# Altium project ESP_Dent.PrjPcb (part 3 of 3)
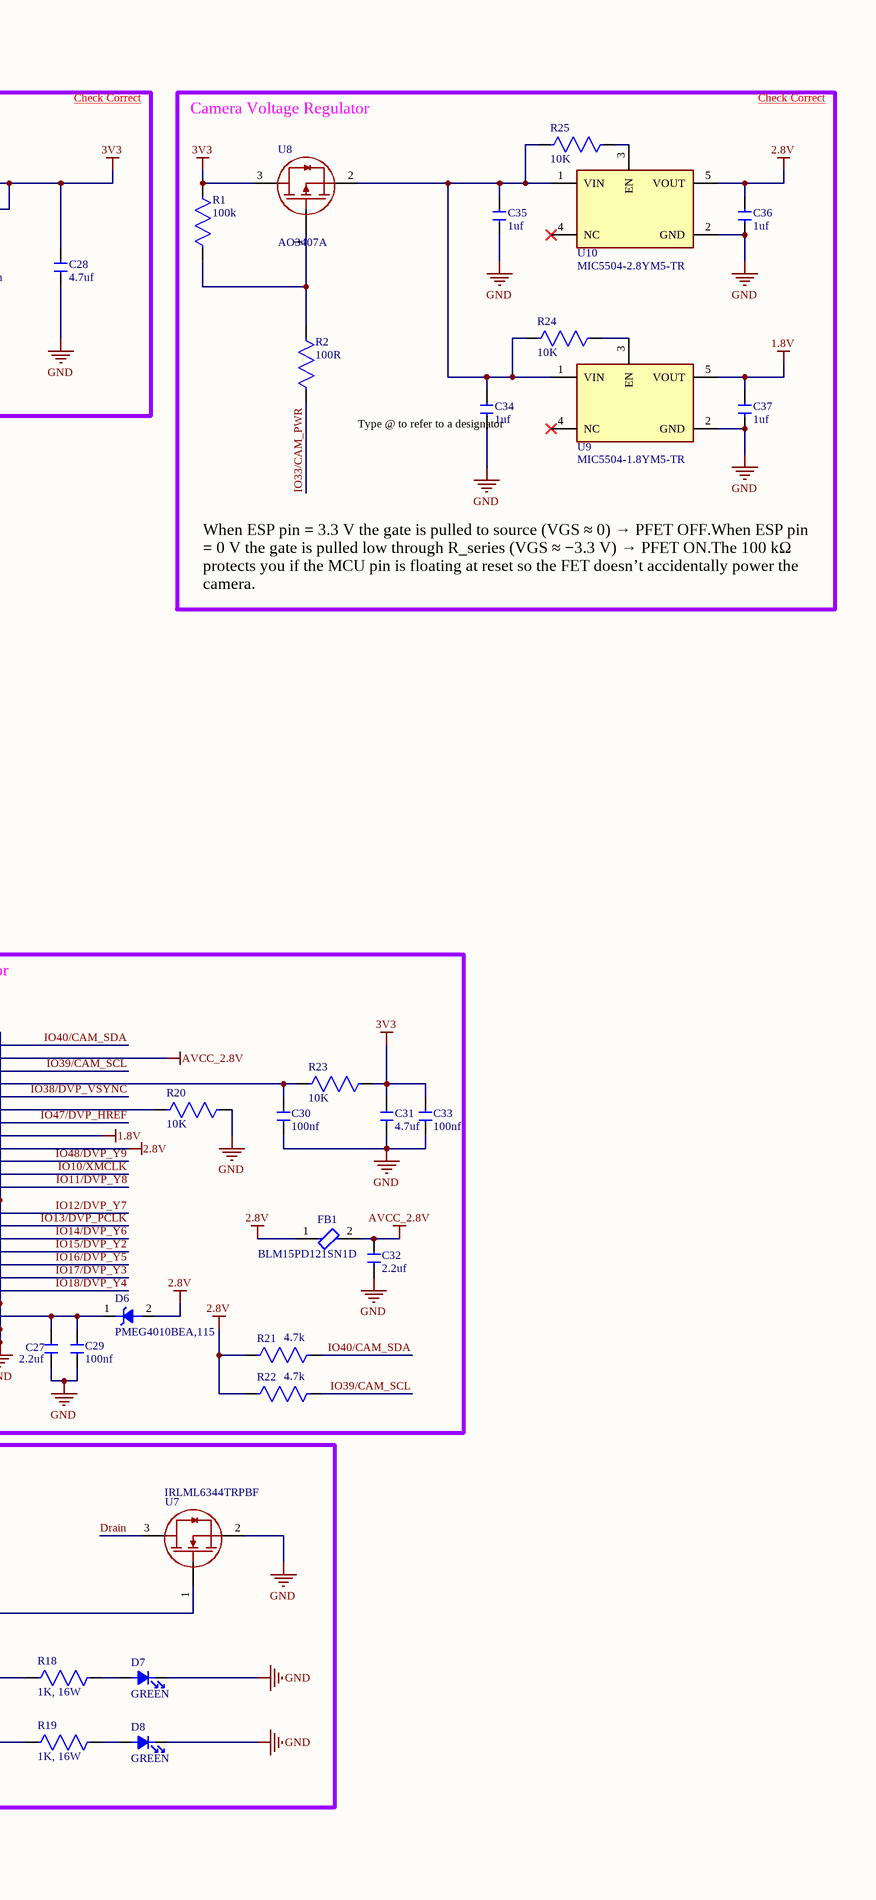
[diagram p3: Dent_Sheet_ESP.SchDoc, right]

## Sheet Dent_Sheet_ESP.SchDoc (continued)

### Library data of the parts (continued)
U1 = ESP32-S3R8: IC RF TXRX+MCU BLE 56QFN; Manufacturer: Espressif Systems; Supplier: Digikey; Supplier Part Number: 1904-ESP32-S3R8CT-ND; Manufacturer Part Number: ESP32-S3R8; RoHS: No; Category: RF Receivers, Transceivers; Stock: 792; Pricing: 1=2.3, 2000=2.28001 (USD); ComponentLink1URL: https://datasheet.octopart.com/ESP32-S3R8-Espressif-Systems-datasheet-188867343.pdf?src-supplier=TME; ComponentLink1Description: https://datasheet.octopart.com/ESP32-S3R8-Espressif-Systems-datasheet-188867343.pdf?src-supplier=TME; LCSC Part No.: C2913194
U2 = DMG3415U-7: P-Channel 20 V 4A (Ta) 900mW (Ta) Surface Mount SOT-23-3; Manufacturer: Diodes; Package Body Material: Plastic; Transistor Element Material: SILICON; Additional Feature: HIGH RELIABILITY; Drain-source On Resistance-Max: 42.5mR; DS Breakdown Voltage-Min: 20V; FET Technology: METAL-OXIDE SEMICONDUCTOR; Number of Elements: 1; Operating Mode: ENHANCEMENT MODE; Time @ Peak Reflow Temperature-Max (s): 40s; Transistor Application: SWITCHING; Qualification Status: Not Qualified; Supplier: Digikey; Supplier Part Number: DMG3415UDICT-ND; Manufacturer Part Number: DMG3415U-7; RoHS: Yes; Category: MOSFETs; Stock: 10798; Pricing: 1=0.45, 10=0.277, 100=0.1743, 500=0.13838 (USD); Pins: 3; Package Shape: Rectangular; Terminal Finish: Tin; Max Operating Temperature: 150°C; JESD-609 Code: e3; Polarity/Channel Type: P-CHANNEL; Drain Current-Max (Abs) (ID): 4A; Drain Current-Max (ID): 4A; JESD-30 Code: R-PDSO-G3; Moisture Sensitivity Level: 1; Package Style: SMALL OUTLINEMeter; Peak Reflow Temperature (Cel): 260°C; Power Dissipation-Max (Abs): 900mW; Surface Mount: Yes; Terminal Form: Gull Wing; Terminal Position: DUAL; Reach SVHC Compliant: Yes; RoHS Compliant: Yes; ComponentLink1URL: https://datasheet.ciiva.com:443/pdfs/VipMasterIC/IC/DIOD/DIOD-S-A0004428614/DIOD-S-A0004428614-1.pdf?src-supplier=IHS+Markit; ComponentLink1Description: https://datasheet.ciiva.com:443/pdfs/VipMasterIC/IC/DIOD/DIOD-S-A0004428614/DIOD-S-A0004428614-1.pdf?src-supplier=IHS+Markit; ComponentLink2URL: https://datasheet.ciiva.com/11174/ds31735-11174977.pdf?src-supplier=Avnet; ComponentLink2Description: https://datasheet.ciiva.com/11174/ds31735-11174977.pdf?src-supplier=Avnet; ComponentLink3URL: https://datasheet.ciiva.com/13061/ds31735-64958-13061831.pdf?src-supplier=Mouser; ComponentLink3Description: https://datasheet.ciiva.com/13061/ds31735-64958-13061831.pdf?src-supplier=Mouser; ComponentLink4URL: https://datasheet.ciiva.com/935/ds31735-935013.pdf?src-supplier=Digikey; ComponentLink4Description: https://datasheet.ciiva.com/935/ds31735-935013.pdf?src-supplier=Digikey; ComponentLink5URL: https://datasheet.ciiva.com/935/ds31735-935014.pdf?src-supplier=Digikey; ComponentLink5Description: https://datasheet.ciiva.com/935/ds31735-935014.pdf?src-supplier=Digikey; ComponentLink6URL: https://datasheet.ciiva.com/935/ds31735-935015.pdf?src-supplier=Digikey; ComponentLink6Description: https://datasheet.ciiva.com/935/ds31735-935015.pdf?src-supplier=Digikey; ComponentLink7URL: https://datasheet.ciiva.com/8115/ds31735-8115357.pdf?src-supplier=Avnet; ComponentLink7Description: https://datasheet.ciiva.com/8115/ds31735-8115357.pdf?src-supplier=Avnet; ComponentLink8URL: https://datasheet.ciiva.com/8023/ds31735-8023980.pdf?src-supplier=Element14; ComponentLink8Description: https://datasheet.ciiva.com/8023/ds31735-8023980.pdf?src-supplier=Element14; ComponentLink9URL: https://datasheet.ciiva.com/22712/1915618-22712394.pdf?src-supplier=Element14; ComponentLink9Description: https://datasheet.ciiva.com/22712/1915618-22712394.pdf?src-supplier=Element14; ComponentLink10URL: https://datasheet.ciiva.com/16387/ds31735-16387485.pdf?src-supplier=Future+Electronics; ComponentLink10Description: https://datasheet.ciiva.com/16387/ds31735-16387485.pdf?src-supplier=Future+Electronics; LCSC Part No.: C96616
U4 = MCP73831T-2ACI/OT: IC BATT CNTL LI-ION 1CEL SOT23-5; Manufacturer: Microchip; Package Body Material: Plastic; Adjustable Threshold: Yes; Throw Configuration: POWER SUPPLY SUPPORT CIRCUIT; Number of Channels: 1; Package Equivalence Code: TSOP5/6,.11,37; Power Supplies: 3.3/5V; Supply Current-Max (Isup): 1.5mA; Max Supply Voltage: 6V; Min Supply Voltage: 3.75V; Nominal Supply Voltage: 5.2V; Time @ Peak Reflow Temperature-Max (s): 40s; Qualification Status: Not Qualified; Supplier: Digikey; Supplier Part Number: MCP73831T-2ACI/OTCT-ND; Manufacturer Part Number: MCP73831T-2ACI/OT; RoHS: Yes; Category: Battery Management; Stock: 33354; Pricing: 1=0.76, 25=0.63, 100=0.6125, 3000=0.5831 (USD); Case/Package: LSSOP; Pins: 5; Package Shape: Rectangular; Terminal Finish: Tin; Min Operating Temperature: -40°C; Max Operating Temperature: 85°C; JESD-609 Code: e3; JESD-30 Code: R-PDSO-G5; Moisture Sensitivity Level: 1; Channels: 1; Package Style: SMALL OUTLINE, LOW PROFILE, SHRINK PITCHMeter; Peak Reflow Temperature (Cel): 260°C; Surface Mount: Yes; Terminal Form: Gull Wing; Terminal Position: DUAL; Length: 2.95mm; Width: 1.65mm; Height - Seated (Max): 1.45mm; Terminal Pitch: 0.95mm; Temperature Grade: INDUSTRIAL; Reach SVHC Compliant: Yes; RoHS Compliant: Yes; ComponentLink1URL: https://datasheet.ciiva.com:443/pdfs/VipMasterIC/IC/MCHP/MCHPS05673/MCHPS05673-1.pdf?src-supplier=IHS+Markit; ComponentLink1Description: https://datasheet.ciiva.com:443/pdfs/VipMasterIC/IC/MCHP/MCHPS05673/MCHPS05673-1.pdf?src-supplier=IHS+Markit; ComponentLink2URL: https://datasheet.ciiva.com/22828/0900766b80d2b53a-22828876.pdf?src-supplier=Rs; ComponentLink2Description: https://datasheet.ciiva.com/22828/0900766b80d2b53a-22828876.pdf?src-supplier=Rs; ComponentLink3URL: https://datasheet.ciiva.com/1137/630369-1137803.pdf?src-supplier=Element14; ComponentLink3Description: https://datasheet.ciiva.com/1137/630369-1137803.pdf?src-supplier=Element14; ComponentLink4URL: https://datasheet.ciiva.com/46385/630369-46385324.pdf?src-supplier=Element14; ComponentLink4Description: https://datasheet.ciiva.com/46385/630369-46385324.pdf?src-supplier=Element14; ComponentLink5URL: https://datasheet.ciiva.com/16286/filehandler-aspxddocname-en025112-16286957.pdf?src-supplier=Future+Electronics; ComponentLink5Description: https://datasheet.ciiva.com/16286/filehandler-aspxddocname-en025112-16286957.pdf?src-supplier=Future+Electronics; ComponentLink6URL: https://datasheet.ciiva.com/1931/21984e-1931954.pdf?src-supplier=Digikey; ComponentLink6Description: https://datasheet.ciiva.com/1931/21984e-1931954.pdf?src-supplier=Digikey; ComponentLink7URL: https://datasheet.ciiva.com/1931/21984e-1931955.pdf?src-supplier=Digikey; ComponentLink7Description: https://datasheet.ciiva.com/1931/21984e-1931955.pdf?src-supplier=Digikey; ComponentLink8URL: https://datasheet.ciiva.com/1931/21984e-1931953.pdf?src-supplier=Digikey; ComponentLink8Description: https://datasheet.ciiva.com/1931/21984e-1931953.pdf?src-supplier=Digikey; LCSC Part No.: C42432883
U5 = GD25Q64ETIGR: 2.7V~3.6V -40℃~85℃ 64MBIT 133MHZ SOP-8-150MIL Nor Flash Rohs; Manufacturer: GigaDevice; Interface: Serial; Max Supply Current: 25mA; Max Supply Voltage: 3.6V; Min Supply Voltage: 3V; Number of Circuits: 1; Operating Supply Voltage: 3.3V; Supplier: DigiKey; Supplier Part Number: 1970-GD25Q64ETIGRCT-ND; Manufacturer Part Number: GD25Q64ETIGR; RoHS: Compliant; Category: Flash; Stock: 3294; Pricing: 1=1.05, 10=0.985, 25=0.958, 50=0.9372, 100=0.9161, 250=0.8882, 500=0.8671, 1000=0.8461 (USD); Clock Rate: 133MHz; Height - Seated (Max): 1.75mm; Length: 4.9mm; Max Operating Temperature: 85°C; Memory Format: FLASH; Min Operating Temperature: -40°C; Number of Terminals: 8; Terminal Pitch: 1.27mm; Width: 3.9mm; ComponentLink1URL: https://datasheet.octopart.com:443/GD25Q64ETIGR-GigaDevice-datasheet-182344543.pdf?src-supplier=IHS; ComponentLink1Description: https://datasheet.octopart.com:443/GD25Q64ETIGR-GigaDevice-datasheet-182344543.pdf?src-supplier=IHS; LCSC Part No.: C2976334
U6 = TPS628438DRLR: Buck Switching Regulator IC Positive Programmable 1.8V 1 Output 600mA SOT-563, SOT-666; Manufacturer: Texas Instruments; Supplier: Digikey; Supplier Part Number: 296-TPS628438DRLRCT-ND; Manufacturer Part Number: TPS628438DRLR; RoHS: No; Category: LDO; Stock: 2001; Pricing: 1=1.55, 10=1.13, 25=1.026, 100=0.9116, 250=0.857, 500=0.82408, 1000=0.79698 (USD); LCSC Part No.: C38060243
U7 = IRLML6344TRPBF: MOSFET N-CH 30V 5A MICRO3/SOT23; Manufacturer: Infineon; Manufacturer Package Identifier: Micro3; Drain to Source Resistance: 29mΩ; Element Configuration: Single; Fall Time: 9.1ns; Gate to Source Voltage (Vgs): 12V; Input Capacitance: 650pF; Max Junction Temperature (Tj): 150°C; Max Power Dissipation: 1.3W; Nominal Vgs: 800mV; Number of Channels: 1; Recovery Time: 15ns; Value: 37MΩ; Rise Time: 5.6ns; Turn-Off Delay Time: 22ns; Turn-On Delay Time: 4.2ns; Supplier: DigiKey; Supplier Part Number: IRLML6344TRPBFCT-ND; Manufacturer Part Number: IRLML6344TRPBF; RoHS: Compliant; Category: MOSFETs; Stock: 89780; Pricing: 1=0.38, 10=0.249, 100=0.1612, 500=0.1424, 1000=0.12703 (USD); Case/Package: SOT-23; Continuous Drain Current (ID): 5A; Drain to Source Breakdown Voltage: 30V; Drain to Source Voltage (Vdss): 30V; Height: 1.12mm; Lead Free: Lead Free; Length: 3.04mm; Lifecycle Status: Production; Max Operating Temperature: 150°C; Min Breakdown Voltage: 30V; Min Operating Temperature: -55°C; Mounting Technology: Surface Mount; Number of Elements: 1; Pins: 3; Number of Terminals: 3; On-State Resistance: 29mΩ; Package Quantity: 3000; Packaging: Tape & Reel; Power Dissipation: 1.3W; Radiation Hardening: No; Rds On Max: 29mΩ; REACH SVHC: Yes; Schedule B: 8541290080, 8541290080|8541290080|8541290080|8541290080|8541290080; Threshold Voltage: 800mV; Width: 1.4mm; ComponentLink1URL: https://datasheet.octopart.com:443/IRLML6344TRPBF-Infineon-datasheet-166549069.pdf?src-supplier=IHS; ComponentLink1Description: https://datasheet.octopart.com:443/IRLML6344TRPBF-Infineon-datasheet-166549069.pdf?src-supplier=IHS; ComponentLink2URL: https://datasheet.octopart.com:443/IRLML6344TRPBF-Infineon-datasheet-41230536.pdf?src-supplier=element14+APAC; ComponentLink2Description: https://datasheet.octopart.com:443/IRLML6344TRPBF-Infineon-datasheet-41230536.pdf?src-supplier=element14+APAC; ComponentLink3URL: https://datasheet.octopart.com:443/IRLML6344TRPBF-Infineon-datasheet-10031181.pdf?src-supplier=Farnell; ComponentLink3Description: https://datasheet.octopart.com:443/IRLML6344TRPBF-Infineon-datasheet-10031181.pdf?src-supplier=Farnell; ComponentLink4URL: https://sigma.octopart.com:443/138896058/technical_drawing/Infineon-IRLML6344TRPBF.pdf?src-supplier=Upverter; ComponentLink4Description: https://sigma.octopart.com:443/138896058/technical_drawing/Infineon-IRLML6344TRPBF.pdf?src-supplier=Upverter; ComponentLink5URL: https://datasheet.octopart.com:443/IRLML6344TRPBF-International-Rectifier-datasheet-14062076.pdf?src-supplier=iiiC; ComponentLink5Description: https://datasheet.octopart.com:443/IRLML6344TRPBF-International-Rectifier-datasheet-14062076.pdf?src-supplier=iiiC; ComponentLink6URL: http://sigma.octopart.com:80/conflict_mineral_statement/Infineon-company-51.pdf?src-supplier=Compliance+Statements; ComponentLink6Description: http://sigma.octopart.com:80/conflict_mineral_statement/Infineon-company-51.pdf?src-supplier=Compliance+Statements; ComponentLink7URL: http://sigma.octopart.com:80/rohs_statement/International-Rectifier-company-54.pdf?src-supplier=Compliance+Statements; ComponentLink7Description: http://sigma.octopart.com:80/rohs_statement/International-Rectifier-company-54.pdf?src-supplier=Compliance+Statements; ComponentLink8URL: http://sigma.octopart.com:80/reach_statement/International-Rectifier-company-55.pdf?src-supplier=Compliance+Statements; ComponentLink8Description: http://sigma.octopart.com:80/reach_statement/International-Rectifier-company-55.pdf?src-supplier=Compliance+Statements; LCSC Part No.: C53550
U8 = AO3407A: 30V 4.3A 48mΩ@10V 2.5V@250uA 1 P-Channel SOT-23 MOSFETs ROHS; Manufacturer: Alpha & Omega Semiconductor; Package Body Material: Plastic; Transistor Element Material: SILICON; Drain-source On Resistance-Max: 48mR; Feedback Cap-Max (Crss): 90pF; FET Technology: METAL-OXIDE SEMICONDUCTOR; Number of Elements: 1; Operating Mode: ENHANCEMENT MODE; Power Dissipation-Max (Abs): 1.4W; Transistor Application: SWITCHING; Qualification Status: Not Qualified; Supplier: Digikey; Supplier Part Number: 785-1006-1-ND; Manufacturer Part Number: AO3407A; RoHS: Yes; Category: MOSFETs; Stock: 661270; Pricing: 1=0.46, 10=0.282, 100=0.1787, 500=0.1337, 1000=0.11915 (USD); Pins: 3; Package Shape: Rectangular; Terminal Finish: Tin; Max Operating Temperature: 150°C; JESD-609 Code: e3; Polarity/Channel Type: P-CHANNEL; Drain Current-Max (Abs) (ID): 4.3A; Drain Current-Max (ID): 4.3A; DS Breakdown Voltage-Min: 30V; JESD-30 Code: R-PDSO-G3; Moisture Sensitivity Level: 1; Package Style: SMALL OUTLINEMeter; Surface Mount: Yes; Terminal Form: Gull Wing; Terminal Position: DUAL; Reach SVHC Compliant: Yes; RoHS Compliant: Yes; ComponentLink1URL: https://datasheet.ciiva.com:443/pdfs/VipMasterIC/IC/ALOM/ALOMS01464/ALOMS01464-1.pdf?src-supplier=IHS+Markit; ComponentLink1Description: https://datasheet.ciiva.com:443/pdfs/VipMasterIC/IC/ALOM/ALOMS01464/ALOMS01464-1.pdf?src-supplier=IHS+Markit; ComponentLink2URL: https://datasheet.ciiva.com/940/ao3407a-940745.pdf?src-supplier=Digikey; ComponentLink2Description: https://datasheet.ciiva.com/940/ao3407a-940745.pdf?src-supplier=Digikey; ComponentLink3URL: https://datasheet.ciiva.com/940/ao3407a-940747.pdf?src-supplier=Digikey; ComponentLink3Description: https://datasheet.ciiva.com/940/ao3407a-940747.pdf?src-supplier=Digikey; ComponentLink4URL: https://datasheet.ciiva.com/18057/getdatasheetpartid-64436-18057110.pdf?src-supplier=Verical; ComponentLink4Description: https://datasheet.ciiva.com/18057/getdatasheetpartid-64436-18057110.pdf?src-supplier=Verical; LCSC Part No.: C15155
U9 = MIC5504-1.8YM5-TR: IC REG LINEAR 1.8V 300MA SOT23-5; Manufacturer: Microchip; Dropout Voltage: 160mV; Number Of Outputs: 1; Nominal Supply Current: 38-42uA; Accuracy Percentage: 2%; Max Supply Voltage: 5.5V; Max Junction Temp: +125°C; Min Supply Voltage: 2.5V; Standoff Height: 0mm; Output Type: Fixed; Temperature Range Low: -40°C; Temperature Range High: +125°C; Automotive: No; Octopart: https://octopart.com/mic5504-1.8ym5-tr-microchip-66803399; RoHS: TRUE; Device Class L1: Integrated Circuits (ICs); Device Class L3: Voltage Regulators - Linear; Package: SOT23-5LD-PL-1; Device Class L2: Power Management ICs; Output Current: 300mA; Digikey Description: IC REG LINEAR 1.8V 300MA SOT23-5; Lead Free: Yes; Output Voltage: 1.8V; Height: 1.45mm; Category: IC; ComponentLink2Description: Datasheet; Temperature: -40°C to +125°C; ComponentLink2URL: http://ww1.microchip.com/downloads/en/DeviceDoc/MIC5501-02-03-04-300mA-Single-Output-LDO-in-Small-Packages-DS20006006B.pdf; Manufacturer Part Number: MIC5504-1.8YM5-TR; LCSC Part No.: C30197546
U10 = MIC5504-2.8YM5-TR: IC REG LINEAR 2.8V 300MA SOT23-5; Min Input Voltage: 2.5V; Output Type: Fixed; Number of Regulators: 1; Max Input Voltage: 5.5V; Min Current Limit: 400mA; Dropout Voltage: 160mV; Max Operating Temperature: 125°C; Mount: Surface Mount; Min Operating Temperature: -40°C; Case/Package: SOT-23-5; Output Current: 300mA; Number of Pins: 5; Nominal Output Voltage: 2.8V; Output Voltage: 2.8V; REACH SVHC: No SVHC; Packaging: Cut Tape; LCSC Part No.: C95749
Y1 = ABM10W-40.0000MHZ-8-B1U-T3: Crystal, Quartz, 40 MHz, SMD, 2.5mm x 2mm x 0.6mm, 10 ppm, 8 pF, 10 ppm, ABM10W; Manufacturer: Abracon; ESR (Equivalent Series Resistance): 40Ω; Frequency: 40MHz; Frequency Stability: 10ppm; Frequency Tolerance: 0.001%; Load Capacitance: 8pF; ESR: 25Ω; Supplier: DigiKey; Supplier Part Number: 535-13794-1-ND; Manufacturer Part Number: ABM10W-40.0000MHZ-8-B1U-T3; RoHS: Compliant; Category: Crystals; Stock: 42549; Pricing: 1=0.47, 10=0.406, 25=0.3836, 50=0.3678, 100=0.3526, 250=0.3334, 500=0.31962, 1000=0.31386 (USD); China RoHS: Compliant; Height: 600µm; Length: 2.5mm; Lifecycle Status: Production; Max Operating Temperature: 70°C; Min Operating Temperature: -20°C; Mounting Technology: Surface Mount; REACH SVHC: Yes; Schedule B: 8541600060|8541600060|8541600060|8541600060|8541600060; Tolerance: 0.001%; Width: 2mm; ComponentLink1URL: https://datasheet.octopart.com:443/ABM10W-40.0000MHZ-8-B1U-T3-Abracon-datasheet-182204671.pdf?src-supplier=IHS; ComponentLink1Description: https://datasheet.octopart.com:443/ABM10W-40.0000MHZ-8-B1U-T3-Abracon-datasheet-182204671.pdf?src-supplier=IHS; ComponentLink2URL: https://datasheet.octopart.com:443/ABM10W-40.0000MHZ-8-B1U-T3-Abracon-datasheet-104271056.pdf?src-supplier=Future+Electronics; ComponentLink2Description: https://datasheet.octopart.com:443/ABM10W-40.0000MHZ-8-B1U-T3-Abracon-datasheet-104271056.pdf?src-supplier=Future+Electronics; ComponentLink3URL: https://datasheet.octopart.com:443/ABM10W-40.0000MHZ-8-B1U-T3-Abracon-datasheet-101965223.pdf?src-supplier=Abracon+SCT; ComponentLink3Description: https://datasheet.octopart.com:443/ABM10W-40.0000MHZ-8-B1U-T3-Abracon-datasheet-101965223.pdf?src-supplier=Abracon+SCT; ComponentLink4URL: https://sigma.octopart.com:443/141159856/technical_drawing/Abracon-ABM10W-40.0000MHZ-8-B1U-T3.pdf?src-supplier=Abracon+SCT; ComponentLink4Description: https://sigma.octopart.com:443/141159856/technical_drawing/Abracon-ABM10W-40.0000MHZ-8-B1U-T3.pdf?src-supplier=Abracon+SCT; ComponentLink5URL: https://datasheet.octopart.com:443/ABM10W-40.0000MHZ-8-B1U-T3-Abracon-datasheet-189095939.pdf?src-supplier=Master+Electronics; ComponentLink5Description: https://datasheet.octopart.com:443/ABM10W-40.0000MHZ-8-B1U-T3-Abracon-datasheet-189095939.pdf?src-supplier=Master+Electronics; ComponentLink6URL: http://sigma.octopart.com:80/conflict_mineral_statement/Abracon-company-27.pdf?src-supplier=Compliance+Statements; ComponentLink6Description: http://sigma.octopart.com:80/conflict_mineral_statement/Abracon-company-27.pdf?src-supplier=Compliance+Statements; LCSC Part No.: C1985328

## Assembly variants
Prototype_v1.0: all parts fitted